# Altium project MAIN_FET.PrjPCB
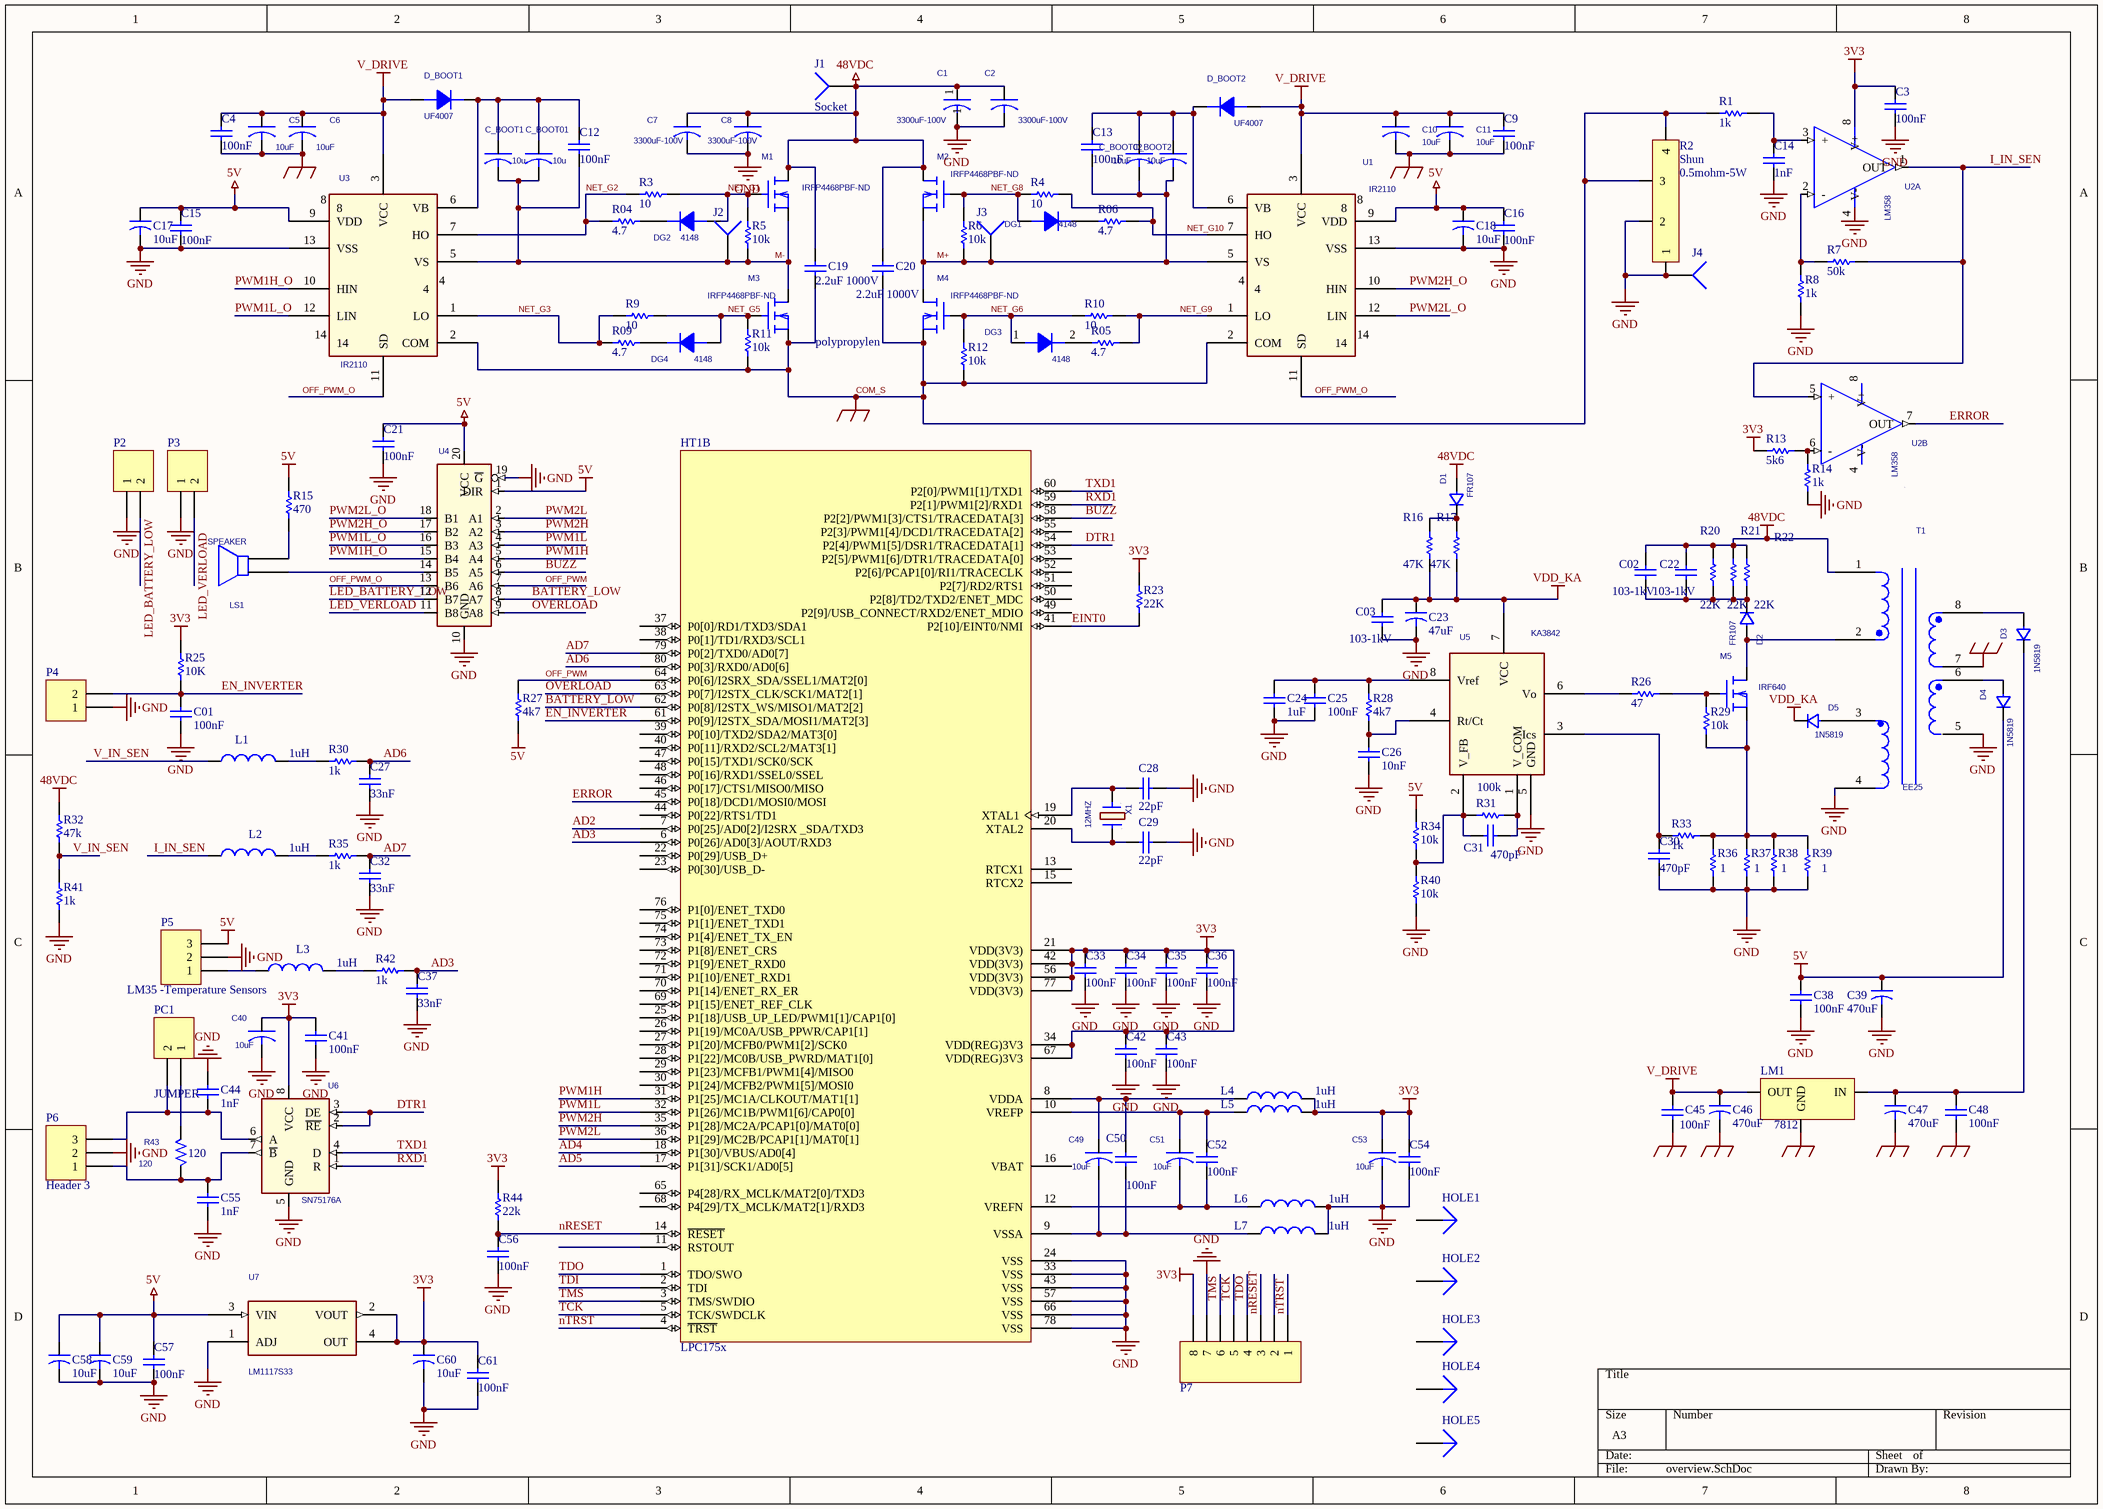
[diagram p0: overview.SchDoc]
1 sheet, 164 parts. Net scope: global (net labels, ports and power ports of the same name join across sheets).
Board file: PCB_PRO_OK_08-08-2011.PcbDoc

## Sheet overview.SchDoc
size A3

### Parts
C1  3300uF-100V  [3300uF_NEW]
C01  value 100nF  [C0805]  (hidden comment: CX4)
C2  3300uF-100V  [3300uF_NEW]
C02  value 103-1kV  [C0805]  (hidden comment: CX4)
C3  value 100nF  [C0805]  (hidden comment: CX4)
C03  value 103-1kV  [C0805]  (hidden comment: CX4)
C4  value 100nF  [C0805]  (hidden comment: cap SMD)
C5  10uF  [CAP_10uF_SMD]
C6  10uF  [CAP_10uF_SMD]
C7  3300uF-100V  [3300uF_NEW]
C8  3300uF-100V  [3300uF_NEW]
C9  value 100nF  [C0805]  (hidden comment: cap SMD)
C10  10uF  [CAP_10uF_SMD]
C11  10uF  [CAP_10uF_SMD]
C12  value 100nF  [C0805]  (hidden comment: cap SMD)
C13  value 100nF  [C0805]  (hidden comment: cap SMD)
C14  value 1nF  [C0805]  (hidden comment: CX4)
C15  value 100nF  [C0805]  (hidden comment: CX4)
C16  value 100nF  [C0805]  (hidden comment: CX4)
C17  value 10uF  [CAP_10uF_SMD]  (hidden comment: CAP SMD1206)
C18  value 10uF  [CAP_10uF_SMD]  (hidden comment: CAP SMD1206)
C19  polypropylen  value 2.2uF 1000V  [2.2UF-1000V_NEW]
C20  value 2.2uF 1000V  [2.2UF-1000V_NEW]  (hidden comment: polypropylen)
C21  value 100nF  [C0805]  (hidden comment: cap SMD)
C22  value 103-1kV  [C0805]  (hidden comment: CX4)
C23  value 47uF  [CAP_10uF_SMD]  (hidden comment: CAP SMD1206)
C24  value 1uF  [C0805]  (hidden comment: CX4)
C25  value 100nF  [C0805]  (hidden comment: CX4)
C26  value 10nF  [C0805]  (hidden comment: CX4)
C27  value 33nF  [C0805]  (hidden comment: CX4)
C28  value 22pF  [C0805]  (hidden comment: CX4)
C29  value 22pF  [C0805]  (hidden comment: CX4)
C30  value 470pF  [C0805]  (hidden comment: CX4)
C31  value 470pF  [C0805]  (hidden comment: CX4)
C32  value 33nF  [C0805]  (hidden comment: CX4)
C33  value 100nF  [C0805]  (hidden comment: CX4)
C34  value 100nF  [C0805]  (hidden comment: CX4)
C35  value 100nF  [C0805]  (hidden comment: CX4)
C36  value 100nF  [C0805]  (hidden comment: CX4)
C37  value 33nF  [C0805]  (hidden comment: CX4)
C38  value 100nF  [C0805]  (hidden comment: CX4)
C39  value 470uF  [Tu470]  (hidden comment: CAP SMD1206)
C40  10uF  [CAP_10uF_SMD]
C41  value 100nF  [C0805]  (hidden comment: CX4)
C42  value 100nF  [C0805]  (hidden comment: CX4)
C43  value 100nF  [C0805]  (hidden comment: CX4)
C44  value 1nF  [C0805]  (hidden comment: CX4)
C45  value 100nF  [C0805]  (hidden comment: CX4)
C46  value 470uF  [Tu470]  (hidden comment: CAP SMD1206)
C47  value 470uF  [Tu470]  (hidden comment: CAP SMD1206)
C48  value 100nF  [C0805]  (hidden comment: CX4)
C49  10uF  [CAP_10uF_SMD]
C50  value 100nF  [C0805]  (hidden comment: CX4)
C51  10uF  [CAP_10uF_SMD]
C52  value 100nF  [C0805]  (hidden comment: CX4)
C53  10uF  [CAP_10uF_SMD]
C54  value 100nF  [C0805]  (hidden comment: CX4)
C55  value 1nF  [C0805]  (hidden comment: CX4)
C56  value 100nF  [C0805]  (hidden comment: CX4)
C57  value 100nF  [C0805]  (hidden comment: CX4)
C58  value 10uF  [CAP_10uF_SMD]  (hidden comment: CAP SMD1206)
C59  value 10uF  [CAP_10uF_SMD]  (hidden comment: CAP SMD1206)
C60  value 10uF  [CAP_10uF_SMD]  (hidden comment: CAP SMD1206)
C61  value 100nF  [C0805]  (hidden comment: CX4)
C_BOOT1  10u  [CAP_10uF_SMD]
C_BOOT01  10u  [CAP_10uF_SMD]
C_BOOT2  10uF  [CAP_10uF_SMD]
C_BOOT02  10uF  [CAP_10uF_SMD]
D1  FR107  [DIODE5819_V1]
D2  FR107  [DIODE5819_V1]
D3  1N5819  [DIODE5819_V1]
D4  1N5819  [DIODE5819_V1]
D5  1N5819  [DIODE5819_V1]
D_BOOT1  UF4007  [DIODE5819_V1]
D_BOOT2  UF4007  [DIODE5819_V1]
DG1  4148  [4148_SMD]
DG2  4148  [4148_SMD]
DG3  4148  [4148_SMD]
DG4  4148  [4148_SMD]
HOLE1  HOLE1  [HOLE]  (value not drawn)
HOLE2  HOLE1  [HOLE]  (value not drawn)
HOLE3  HOLE1  [HOLE]  (value not drawn)
HOLE4  HOLE1  [HOLE]  (value not drawn)
HOLE5  HOLE1  [HOLE]  (value not drawn)
HT1  LPC175x  [PCBComponent_1 - duplicate]  (part B of 2)
J1  Socket  [DAY_50A]
J2  J1  [DAY_50A]  (value not drawn)
J3  J1  [DAY_50A]  (value not drawn)
J4  J1  [DAY_50A]  (value not drawn)
L1  value 1uH  [L_1uH]  (hidden comment: Inductor)
L2  value 1uH  [L_1uH]  (hidden comment: Inductor)
L3  value 1uH  [L_1uH]  (hidden comment: Inductor)
L4  value 1uH  [L_1uH]  (hidden comment: Inductor)
L5  value 1uH  [L_1uH]  (hidden comment: Inductor)
L6  value 1uH  [L_1uH]  (hidden comment: Inductor)
L7  value 1uH  [L_1uH]  (hidden comment: Inductor)
LM1  7812  [TO220AB]
LS1  SPEAKER  [BUZZ]
M1  IRFP4468PBF-ND  [TO247AB]
M2  IRFP4468PBF-ND  [TO247AB]
M3  IRFP4468PBF-ND  [TO247AB]
M4  IRFP4468PBF-ND  [TO247AB]
M5  IRF640  [TO220AB]
P2  Header 2  [CONECTOR_2PIN]  (value not drawn)
P3  Header 2  [CONECTOR_2PIN]  (value not drawn)
P4  Header 2  [CONECTOR_2PIN]  (value not drawn)
P5  LM35 -Temperature Sensors  [CONECTOR_3PIN]
P6  Header 3  [CONECTOR_3PIN]
P7  Header 8  [HDR1X8]  (value not drawn)
PC1  JUMPER  [CONECTOR_2PIN]
R1  value 1k  [R0805]  (hidden comment: Resistor SMD0805)
R2  Shun  value 0.5mohm-5W  [RES_SHUN]
R3  value 10  [R0805]  (hidden comment: Resistor SMD0805)
R4  value 10  [R0805]  (hidden comment: Resistor SMD0805)
R04  value 4.7  [R0805]  (hidden comment: Resistor SMD0805)
R5  value 10k  [R0805]  (hidden comment: Resistor SMD0805)
R05  value 4.7  [R0805]  (hidden comment: Resistor SMD0805)
R6  value 10k  [R0805]  (hidden comment: Resistor SMD0805)
R06  value 4.7  [R0805]  (hidden comment: Resistor SMD0805)
R7  value 50k  [R0805]  (hidden comment: Resistor SMD0805)
R8  value 1k  [R0805]  (hidden comment: Resistor SMD0805)
R9  value 10  [R0805]  (hidden comment: Resistor SMD0805)
R09  value 4.7  [R0805]  (hidden comment: Resistor SMD0805)
R10  value 10  [R0805]  (hidden comment: Resistor SMD0805)
R11  value 10k  [R0805]  (hidden comment: Resistor SMD0805)
R12  value 10k  [R0805]  (hidden comment: Resistor SMD0805)
R13  value 5k6  [R0805]  (hidden comment: Resistor SMD0805)
R14  value 1k  [R0805]  (hidden comment: Resistor SMD0805)
R15  value 470  [R0805]  (hidden comment: Resistor SMD0805)
R16  value 47K  [R0805]  (hidden comment: Resistor SMD0805)
R17  value 47K  [R0805]  (hidden comment: Resistor SMD0805)
R20  value 22K  [R0805]  (hidden comment: Resistor SMD0805)
R21  value 22K  [R0805]  (hidden comment: Resistor SMD0805)
R22  value 22K  [R0805]  (hidden comment: Resistor SMD0805)
R23  value 22K  [R0805]  (hidden comment: Resistor SMD0805)
R25  value 10K  [R0805]  (hidden comment: Resistor SMD0805)
R26  value 47  [R0805]  (hidden comment: Resistor SMD0805)
R27  value 4k7  [R0805]  (hidden comment: Resistor SMD0805)
R28  value 4k7  [R0805]  (hidden comment: Resistor SMD0805)
R29  value 10k  [R0805]  (hidden comment: Resistor SMD0805)
R30  value 1k  [R0805]  (hidden comment: Resistor SMD0805)
R31  value 100k  [R0805]  (hidden comment: Resistor SMD0805)
R32  value 47k  [R0805]  (hidden comment: Resistor SMD0805)
R33  value 1k  [R0805]  (hidden comment: Resistor SMD0805)
R34  value 10k  [R0805]  (hidden comment: Resistor SMD0805)
R35  value 1k  [R0805]  (hidden comment: Resistor SMD0805)
R36  value 1  [R0805]  (hidden comment: Resistor SMD0805)
R37  value 1  [R0805]  (hidden comment: Resistor SMD0805)
R38  value 1  [R0805]  (hidden comment: Resistor SMD0805)
R39  value 1  [R0805]  (hidden comment: Resistor SMD0805)
R40  value 10k  [R0805]  (hidden comment: Resistor SMD0805)
R41  value 1k  [R0805]  (hidden comment: Resistor SMD0805)
R42  value 1k  [R0805]  (hidden comment: Resistor SMD0805)
R43  120  [R0805]
R44  value 22k  [R0805]  (hidden comment: Resistor SMD0805)
T1  EE25  [TRANSFORMER]
U1  IR2110  [74HC14]
U2  LM358  [SOIC_8PIN]  (parts A,B of 2)
U3  IR2110  [74HC14]
U4  74HCT245  [74HCT245D_STO163]  (value not drawn)
U5  KA3842  [SOIC_8PIN]
U6  SN75176A  [SOIC_8PIN]
U7  LM1117S33  [LM1117]
X1  12MHZ  [CRYSTAL_12Mhz]

### Nets
3V3: C3.2 C33.2 C34.2 C35.2 C36.2 C40.1 C41.2 C42.2 C43.2 C53.1 C54.2 C60.1 C61.2 HT1.21(VDD(3V3)) HT1.34(VDD(REG)3V3) HT1.42(VDD(3V3)) HT1.56(VDD(3V3)) HT1.67(VDD(REG)3V3) HT1.77(VDD(3V3)) L4.2 L5.2 P7.8 R13.1 R23.2 R25.2 R44.2 U2.8(V+) U6.8(VCC) U7.2(VOUT) U7.4(OUT)
5V: C15.2 C16.2 C17.1 C18.1 C21.2 C38.1 C39.1 C57.2 C58.1 C59.1 D4.1 P5.3 R15.2 R27.1 R34.2 U1.9(VDD) U3.9(VDD) U4.1(DIR) U4.20(VCC) U7.3(VIN)
48VDC: C1.1 C2.1 C02.1 C7.1 C8.1 C19.1 C20.1 C22.1 D1.1 J1.1 M1.2(d) M2.2(d) R20.1 R21.1 R22.1 R32.2 T1.1
COM_S: C4.1 C5.2 C6.2 C9.1 C10.2 C11.2 C19.2 C20.2 C45.2 C46.2 C47.2 C48.2 LM1.2(GND) M3.3(s) M4.3(s) R1.2 R2.3 R2.4 R11.2 R12.2 T1.7 U1.2(COM) U3.2(COM)  [also labelled GND_EARTH]
GND: C01.1 C1.2 C2.2 C3.1 C03.2 C7.2 C8.2 C14.1 C15.1 C16.1 C17.2 C18.2 C21.1 C23.2 C24.2 C25.2 C26.2 C27.1 C28.1 C29.1 C30.1 C32.1 C33.1 C34.1 C35.1 C36.1 C37.1 C38.2 C39.2 C40.2 C41.1 C42.1 C43.1 C44.2 C53.2 C54.1 C55.1 C56.1 C57.1 C58.2 C59.2 C60.2 C61.1 HT1.24(VSS) HT1.33(VSS) HT1.43(VSS) HT1.57(VSS) HT1.66(VSS) HT1.78(VSS) J4.1 L6.2 L7.2 P2.1 P3.1 P4.1 P5.2 P6.2 P7.7 R2.1 R2.2 R8.2 R14.2 R36.2 R37.2 R38.2 R39.2 R40.1 R41.1 T1.4 T1.5 U1.13(VSS) U2.4(V-) U3.13(VSS) U4.10(GND) U4.19(~{G}) U5.5(GND) U6.5(GND) U7.1(ADJ)
V_DRIVE: C4.2 C5.1 C6.1 C9.2 C10.1 C11.1 C45.1 C46.1 D_BOOT1.1(A) D_BOOT2.1(A) LM1.3(OUT) U1.3(VCC) U3.3(VCC)
VDD_KA: C03.1 C23.1 D5.1 R16.2 R17.2 U5.7(VCC)
AD2: HT1.7(P0[25]/AD0[2]/I2SRX__SDA/TXD3)
AD3: C37.2 HT1.6(P0[26]/AD0[3]/AOUT/RXD3) R42.1
AD4: HT1.18(P1[30]/VBUS/AD0[4])
AD5: HT1.17(P1[31]/SCK1/AD0[5])
AD6: C27.2 HT1.80(P0[3]/RXD0/AD0[6]) R30.1
AD7: C32.2 HT1.79(P0[2]/TXD0/AD0[7]) R35.1
BATTERY_LOW: HT1.62(P0[8]/I2STX_WS/MISO1/MAT2[2]) U4.8(A7)
BUZZ: HT1.58(P2[2]/PWM1[3]/CTS1/TRACEDATA[3]) U4.6(A5)
DTR1: HT1.54(P2[4]/PWM1[5]/DSR1/TRACEDATA[1]) U6.2(~{RE}) U6.3(DE)
EINT0: HT1.41(P2[10]/EINT0/NMI) R23.1
EN_INVERTER: C01.2 HT1.61(P0[9]/I2STX_SDA/MOSI1/MAT2[3]) P4.2 R25.1
ERROR: HT1.45(P0[18]/DCD1/MOSI0/MOSI) U2.7(OUT)
I_IN_SEN: L2.1 R7.2 U2.1(OUT) U2.5(+)
LED_BATTERY_LOW: P2.2 U4.12(B7)
LED_VERLOAD: P3.2 U4.11(B8)
M+: C13.1 C_BOOT2.2 C_BOOT02.2 J3.1 M2.3(s) M4.2(d) R6.2 U1.5(VS)
M-: C12.1 C_BOOT1.2 C_BOOT01.2 J2.1 M1.3(s) M3.2(d) R5.2 U3.5(VS)
NET_G1: DG2.1(A) M1.1(g) R3.1 R5.1
NET_G2: R3.2 R04.2 U3.7(HO)
NET_G3: R9.2 R09.2 U3.1(LO)
NET_G5: DG4.1(A) M3.1(g) R9.1 R11.1
NET_G6: DG3.1(A) M4.1(g) R10.2 R12.1
NET_G8: DG1.1(A) M2.1(g) R4.2 R6.1
NET_G9: R05.1 R10.1 U1.1(LO)
NET_G10: R4.1 R06.1 U1.7(HO)
nRESET: C56.2 HT1.14(~{RESET}) P7.3 R44.1
nTRST: HT1.4(~{TRST}) P7.1
OFF_PWM: HT1.64(P0[6]/I2SRX_SDA/SSEL1/MAT2[0]) R27.2 U4.7(A6)
OFF_PWM_O: U1.11(SD) U3.11(SD) U4.13(B6)
OVERLOAD: HT1.63(P0[7]/I2STX_CLK/SCK1/MAT2[1]) U4.9(A8)
PWM1H: HT1.31(P1[25]/MC1A/CLKOUT/MAT1[1]) U4.5(A4)
PWM1H_O: U3.10(HIN) U4.15(B4)
PWM1L: HT1.32(P1[26]/MC1B/PWM1[6]/CAP0[0]) U4.4(A3)
PWM1L_O: U3.12(LIN) U4.16(B3)
PWM2H: HT1.35(P1[28]/MC2A/PCAP1[0]/MAT0[0]) U4.3(A2)
PWM2H_O: U1.10(HIN) U4.17(B2)
PWM2L: HT1.36(P1[29]/MC2B/PCAP1[1]/MAT0[1]) U4.2(A1)
PWM2L_O: U1.12(LIN) U4.18(B1)
RXD1: HT1.59(P2[1]/PWM1[2]/RXD1) U6.1(R)
TCK: HT1.5(TCK/SWDCLK) P7.5
TDI: HT1.2(TDI)
TDO: HT1.1(TDO/SWO) P7.4
TMS: HT1.3(TMS/SWDIO) P7.6
TXD1: HT1.60(P2[0]/PWM1[1]/TXD1) U6.4(D)
V_IN_SEN: L1.1 R32.1 R41.2
NetC02_2: C02.2 C22.2 D2.1 R20.2 R21.2 R22.2
NetC12_2: C12.2 C_BOOT1.1 C_BOOT01.1 D_BOOT1.2(K) U3.6(VB)
NetC13_2: C13.2 C_BOOT2.1 C_BOOT02.1 D_BOOT2.2(K) U1.6(VB)
NetC14_2: C14.2 R1.1 U2.3(+)
NetC24_1: C24.1 C25.1 R28.2 U5.8(Vref)
NetC26_1: C26.1 R28.1 U5.4(Rt/Ct)
NetC28_2: C28.2 HT1.19(XTAL1) X1.1
NetC29_2: C29.2 HT1.20(XTAL2) X1.2
NetC30_2: C30.2 R33.1 U5.3(Ics)
NetC31_1: C31.1 R31.2 U5.1(V_COM)
NetC31_2: C31.2 R31.1 R34.1 R40.2 U5.2(V_FB)
NetC44_1: C44.1 P6.3 PC1.2 U6.6(A)
NetC47_1: C47.1 C48.1 D3.1 LM1.1(IN)
NetC49_1: C49.1 C50.2 HT1.8(VDDA) L4.1
NetC49_2: C49.2 C50.1 HT1.9(VSSA) L7.1
NetC51_1: C51.1 C52.2 HT1.10(VREFP) L5.1
NetC51_2: C51.2 C52.1 HT1.12(VREFN) L6.1
NetC55_2: C55.2 P6.1 R43.1 U6.7(~{B})
NetD1_2: D1.2 R16.1 R17.1
NetD2_2: D2.2 M5.2(d) T1.2
NetD3_2: D3.2 T1.8
NetD4_2: D4.2 T1.6
NetD5_2: D5.2 T1.3
NetDG1_2: DG1.2(K) R06.2
NetDG2_2: DG2.2(K) R04.1
NetDG3_2: DG3.2(K) R05.2
NetDG4_2: DG4.2(K) R09.1
NetL1_2: L1.2 R30.2
NetL2_2: L2.2 R35.2
NetL3_1: L3.1 P5.1
NetL3_2: L3.2 R42.2
NetLS1_1: LS1.1 U4.14(B5)
NetLS1_2: LS1.2 R15.1
NetM5_1: M5.1(g) R26.1 R29.1
NetM5_3: M5.3(s) R29.2 R33.2 R36.1 R37.1 R38.1 R39.1
NetPC1_1: PC1.1 R43.2
NetR7_1: R7.1 R8.1 U2.2(-)
NetR13_2: R13.2 R14.1 U2.6(-)
NetR26_2: R26.2 U5.6(Vo)

Not connected (* = marked no-connect by the designer): HOLE1 1; HOLE2 1; HOLE3 1; HOLE4 1; HOLE5 1; HT1 11(RSTOUT) 13(RTCX1) 15(RTCX2) 16(VBAT) 22(P0[29]/USB_D+) 23(P0[30]/USB_D-) 25(P1[18]/USB_UP_LED/PWM1[1]/CAP1[0]) 26(P1[19]/MC0A/USB_PPWR/CAP1[1]) 27(P1[20]/MCFB0/PWM1[2]/SCK0) 28(P1[22]/MC0B/USB_PWRD/MAT1[0]) 29(P1[23]/MCFB1/PWM1[4]/MISO0) 30(P1[24]/MCFB2/PWM1[5]/MOSI0) 37(P0[0]/RD1/TXD3/SDA1) 38(P0[1]/TD1/RXD3/SCL1) 39(P0[10]/TXD2/SDA2/MAT3[0]) 40(P0[11]/RXD2/SCL2/MAT3[1]) 44(P0[22]/RTS1/TD1) 46(P0[17]/CTS1/MISO0/MISO) 47(P0[15]/TXD1/SCK0/SCK) 48(P0[16]/RXD1/SSEL0/SSEL) 49(P2[9]/USB_CONNECT/RXD2/ENET_MDIO) 50(P2[8]/TD2/TXD2/ENET_MDC) 51(P2[7]/RD2/RTS1) 52(P2[6]/PCAP1[0]/RI1/TRACECLK) 53(P2[5]/PWM1[6]/DTR1/TRACEDATA[0]) 55(P2[3]/PWM1[4]/DCD1/TRACEDATA[2]) 65(P4[28]/RX_MCLK/MAT2[0]/TXD3) 68(P4[29]/TX_MCLK/MAT2[1]/RXD3) 69(P1[15]/ENET_REF_CLK) 70(P1[14]/ENET_RX_ER) 71(P1[10]/ENET_RXD1) 72(P1[9]/ENET_RXD0) 73(P1[8]/ENET_CRS) 74(P1[4]/ENET_TX_EN) 75(P1[1]/ENET_TXD1) 76(P1[0]/ENET_TXD0); P7 2; U1 4 8 14; U3 4 8 14

### Library data of the parts
C1 C2 C5-C8 C10 C11 = CAP
C01 C02 C3 C03 C4 C9 C12-C16 C21 C22 C24-C38 C41-C45 C48 C50 C52 C54-C57 C61 = Cap: Capacitor Type 0805 SMD; Published: 8-Jun-2000; LatestRevisionDate: 17-Jul-2002; LatestRevisionNote: Re-released for DXP Platform.; PackageReference: RAD-0.3; Publisher: Altium Limited
C17 C18 C23 C39 C46 C47 C58-C60 = Cap2: Capacitor; Published: 23-Sep-2002; PackageReference: CAPR5-4X5; Publisher: Altium Limited
C19 C20 = Cap Semi: Capacitor polypropylen; Published: 8-Jun-2000; LatestRevisionDate: 29-May-2009; LatestRevisionNote: IPC-7351 Footprint Added.; PackageReference: C1206; Publisher: Altium Limited; PackageDescription: Chip Capacitor
C40 C49 C51 C53 = C
C_BOOT1 C_BOOT01 C_BOOT2 C_BOOT02 = C_Dup1
D1-D5 = 1N4148: PSpiceTemplate: D^@REFDES %1 %2 @MODEL ?AREA/@AREA/; COMPONENT: 1N4148
D_BOOT1 D_BOOT2 DG1 DG2 DG4 = DIODE
DG3 = DIODE_0
HOLE1-HOLE5 = Plug: HOLE; LatestRevisionDate: 17-Jul-2002; LatestRevisionNote: Re-released for DXP Platform.; Publisher: Altium Limited
J2-J4 = Socket: LatestRevisionDate: 17-Jul-2002; LatestRevisionNote: Re-released for DXP Platform.; Publisher: Altium Limited
L1-L7 = Inductor: Inductor Type 1206 SMD; Code_IEC: 1005; Published: 8-Jun-2000; LatestRevisionDate: 29-May-2009; LatestRevisionNote: IPC-7351 Footprint Added.; PackageReference: 0402-A; Publisher: Altium Limited; PackageDescription: Chip Inductor; Code_JEITA: 0402
LM1 = Component_1
M1-M5 = IRF540_Dup1: PSpiceTemplate: M^@REFDES %d %g %s %s @MODEL
P2-P4 PC1 = Header 2: Header, 2-Pin; LatestRevisionDate: 17-Jul-2002; LatestRevisionNote: Re-released for DXP Platform.; Publisher: Altium Limited
P5 P6 = Header 3: Header, 3-Pin; LatestRevisionDate: 17-Jul-2002; LatestRevisionNote: Re-released for DXP Platform.; Publisher: Altium Limited
P7 = Header 8: Header, 8-Pin; LatestRevisionDate: 17-Jul-2002; LatestRevisionNote: Re-released for DXP Platform.; Publisher: Altium Limited
R1 R3 R4 R04 R5 R05 R6 R06-R9 R09-R17 R20-R23 R25-R42 R44 = Res1: Published: 8-Jun-2000; LatestRevisionDate: 17-Jul-2002; LatestRevisionNote: Re-released for DXP Platform.; PackageReference: AXIAL-0.3; Publisher: Altium Limited
R43 = R: PSpiceTemplate: R^@REFDES %1 %2 ?TOLERANCE|R^@REFDES| @VALUE  ?TOLERANCE|\n.model R^@REFDES RES R=1 DEV=@TOLERANCE%|; Value: 120
T1 = TRAN_FBP1S4/SM_5
U1 = IR2110_2
U2 = LM2904/ON: PSpiceTemplate: X^@REFDES %+ %- %V+ %V- %OUT @MODEL
U4 = 74HCT245: IO_LEVEL: 0; PSpiceTemplate: X^@REFDES %DIR %G\ %A1 %A2 %A3 %A4 %A5 %A6 %A7 %A8 %B1 %B2 %B3 %B4 %B5 %B6 %B7 %B8 %VCC %GND @MODEL PARAMS:\n+ IO_LEVEL=@IO_LEVEL MNTYMXDLY=@MNTYMXDLY; MNTYMXDLY: 0
U5 = KA3842_1
U6 = SN75176A_0: PSpiceTemplate: X^@REFDES %R %R\E\ %DE %D %GND %A %B\ %VCC @MODEL
U7 = LM117_0
X1 = QZS10MEG_0: Thach anh 12MHZ; PSpiceTemplate: X^@REFDES %1 %2 @MODEL; COMPHEIGHT: 0.000; MEMORY: NO; COMPGROUP: 0; COMPROT: 270; COMPLOC: [2683.000,1678.000]; COMPSIDE: TOP; DECOUPLER: NO; COMPKEY: NO; COMPLOCKED: NO; COMPFIXED: NO
J1 = Socket: LatestRevisionDate: 17-Jul-2002; LatestRevisionNote: Re-released for DXP Platform.; Publisher: Altium Limited